# EAGLE schematic scoreboard_b2_v2 (EAGLE 9.0.1)
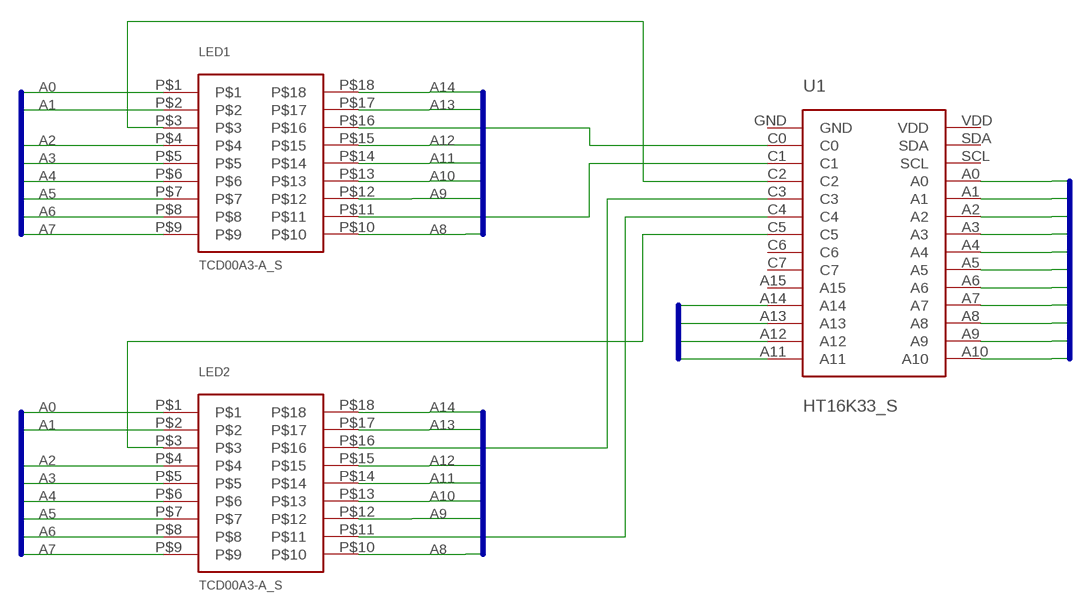
[diagram p0: schematic, sheet 1]

## Parts
LED1  TCD00A3-A_S  [TCD00A3-A]
LED2  TCD00A3-A_S  [TCD00A3-A]
U1  HT16K33_S  [HT16K33]

## Nets
A0: LED1.P$1 LED2.P$1 U1.A0
A1: LED1.P$2 LED2.P$2 U1.A1
A2: LED1.P$4 LED2.P$4 U1.A2
A3: LED1.P$5 LED2.P$5 U1.A3
A4: LED1.P$6 LED2.P$6 U1.A4
A5: LED1.P$7 LED2.P$7 U1.A5
A6: LED1.P$8 LED2.P$8 U1.A6
A7: LED1.P$9 LED2.P$9 U1.A7
A8: LED1.P$10 LED2.P$10 U1.A8
A9: LED1.P$12 LED2.P$12 U1.A9
A10: LED1.P$13 LED2.P$13 U1.A10
A11: LED1.P$14 LED2.P$14 U1.A11
A12: LED1.P$15 LED2.P$15 U1.A12
A13: LED1.P$17 LED2.P$17 U1.A13
A14: LED1.P$18 LED2.P$18 U1.A14
N$1: LED1.P$16 U1.C0
N$2: LED1.P$11 U1.C1
N$3: LED1.P$3 U1.C2
N$4: LED2.P$16 U1.C3
N$5: LED2.P$11 U1.C4
N$6: LED2.P$3 U1.C5
Unconnected: U1.A15 U1.C6 U1.C7 U1.GND U1.SCL U1.SDA U1.VDD

## Buses
HT1A:A[0..7]
HT1B:A[8..14]
A[11..14]
A[0..10]

## Library data of the parts
LED1 LED2 = ScoreBoard:TCD00A3-A_S: 14 Segment LED Display 3 Digits
U1 = ScoreBoard:HT16K33_S: I2C LED Matrix Driver